# EAGLE design ATMega16Motherboard1 (EAGLE 6.2)
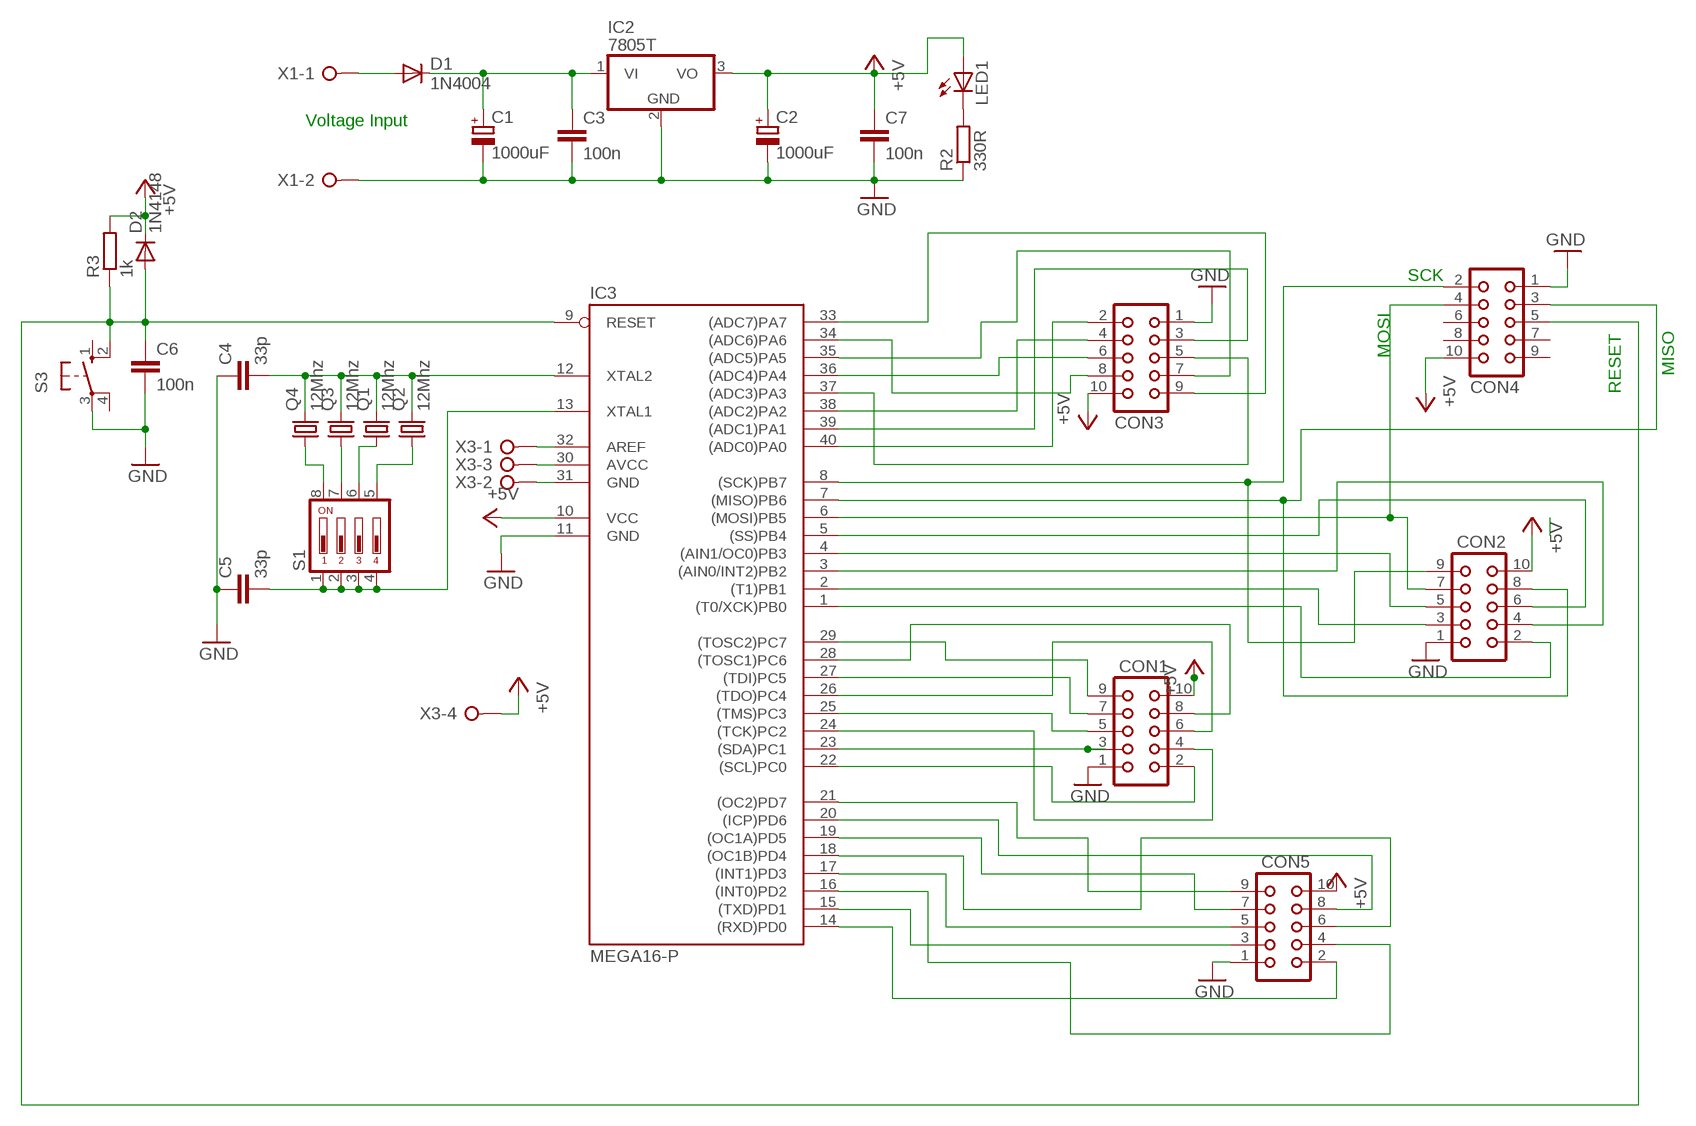
[diagram p0: schematic, sheet 1]

## Parts
C1  1000uF  CPOL-EUE2.5-7  [E2,5-7]
C2  1000uF  CPOL-EUE2.5-7  [E2,5-7]
C3  100n  C-EU025-024X044  [C025-024X044]
C4  33p  C-EU025-024X044  [C025-024X044]
C5  33p  C-EU025-024X044  [C025-024X044]
C6  100n  C-EU025-024X044  [C025-024X044]
C7  100n  C-EU025-024X044  [C025-024X044]
CON1  CON10  [CON10]
CON2  CON10  [CON10]
CON3  CON10  [CON10]
CON4  CON10  [CON10]
CON5  CON10  [CON10]
D1  1N4004  [DO41-10]
D2  1N4148  [DO35-10]
IC2  7805T  [TO220H]
IC3  MEGA16-P  [DIL40]
LED1  LED5MM  [LED5MM]
Q1  12Mhz  CRYSTALHC18U-V  [HC18U-V]
Q2  12Mhz  CRYSTALHC18U-V  [HC18U-V]
Q3  12Mhz  CRYSTALHC18U-V  [HC18U-V]
Q4  12Mhz  CRYSTALHC18U-V  [HC18U-V]
R2  330R  R-EU_0204/5  [0204/5]
R3  1k  R-EU_0204/5  [0204/5]
S1  DIP04YL  [DIP04YL]
S3  10-XX  [B3F-10XX]
X1  W237-02P  [W237-132]
X3  W237-04P  [W237-4P]

## Nets
+5V: C2.+ C7.1 CON1.10 CON2.10 CON3.10 CON4.10 CON5.10 D2.C IC2.3(VO) IC3.10(VCC) LED1.A R3.2 X3.4
GND: C1.- C2.- C3.2 C4.1 C5.1 C6.2 C7.2 CON1.1 CON2.1 CON3.1 CON4.1 CON5.1 IC2.2(GND) IC3.11(GND) R2.1 S3.3(P) X1.2
N$1: D1.A X1.1
N$2: C1.+ C3.1 D1.C IC2.1(VI)
N$3: CON1.2 IC3.22((SCL)PC0)
N$4: CON2.2 IC3.1((T0/XCK)PB0)
N$5: CON2.3 IC3.2((T1)PB1)
N$6: CON1.3 IC3.23((SDA)PC1)
N$7: IC3.32(AREF) X3.1
N$8: CON2.4 IC3.3((AIN0/INT2)PB2)
N$9: CON2.5 IC3.4((AIN1/OC0)PB3)
N$10: CON2.6 IC3.5((SS)PB4)
N$11: CON3.2 IC3.40((ADC0)PA0)
N$12: IC3.30(AVCC) X3.3
N$14: IC3.31(GND) X3.2
N$15: Q4.1 S1.8
N$16: Q3.1 S1.7
N$17: Q1.1 S1.6
N$18: Q2.1 S1.5
N$19: CON3.3 IC3.39((ADC1)PA1)
N$20: CON1.4 IC3.24((TCK)PC2)
N$21: LED1.K(C) R2.2
N$24: CON2.9 CON4.2 IC3.8((SCK)PB7)
N$25: CON2.7 CON4.4 IC3.6((MOSI)PB5)
N$26: CON2.8 CON4.3 IC3.7((MISO)PB6)
N$27: CON5.7 IC3.19((OC1A)PD5)
N$28: C5.2 IC3.13(XTAL1) S1.1 S1.2 S1.3 S1.4
N$29: C4.2 IC3.12(XTAL2) Q1.2 Q2.2 Q3.2 Q4.2
N$30: C6.1 CON4.5 D2.A IC3.9(RESET) R3.1 S3.2(S1)
N$31: CON3.4 IC3.38((ADC2)PA2)
N$32: CON3.5 IC3.37((ADC3)PA3)
N$33: CON3.6 IC3.36((ADC4)PA4)
N$34: CON3.7 IC3.35((ADC5)PA5)
N$36: CON3.8 IC3.34((ADC6)PA6)
N$37: CON3.9 IC3.33((ADC7)PA7)
N$38: CON1.5 IC3.25((TMS)PC3)
N$39: CON1.6 IC3.26((TDO)PC4)
N$40: CON1.7 IC3.27((TDI)PC5)
N$41: CON1.8 IC3.28((TOSC1)PC6)
N$42: CON1.9 IC3.29((TOSC2)PC7)
N$43: CON5.9 IC3.21((OC2)PD7)
N$44: CON5.8 IC3.20((ICP)PD6)
N$45: CON5.6 IC3.18((OC1B)PD4)
N$46: CON5.5 IC3.17((INT1)PD3)
N$47: CON5.4 IC3.16((INT0)PD2)
N$48: CON5.3 IC3.15((TXD)PD1)
N$49: CON5.2 IC3.14((RXD)PD0)
Unconnected: CON4.6 CON4.7 CON4.8 CON4.9 S3.1(S) S3.4(P1)

## Notes on the sheet
- Voltage Input
- SCK
- MOSI
- MISO
- RESET

## Library data of the parts
C1 C2 = rcl:CPOL-EU: POLARIZED CAPACITOR, European symbol
C3-C7 = rcl:C-EU: CAPACITOR, European symbol
CON1-CON5 = con-harting:CON10: CONNECTOR
D1 = diode:1N4004: DIODE general purpose rectifier, 1 A
D2 = diode:1N4148: DIODE high speed (Philips)
IC2 = linear:78*: Positive VOLTAGE REGULATOR Source: http://cache.national.com/ds/LM/LM78L05.pdf http://www.fairchildsemi.com/ds/LM/LM7805.pdf
IC3 = atmel:MEGA16-P: MICROCONTROLLER 16 Kbytes FLASH 1 kbytes SRAM 512 bytes EEPROM USART 8-channel 10 bit ADC Source: avr.lbr; MPN: ATMEGA16-16PU; OC_FARNELL: 9171142; OC_NEWARK: 01M6885
LED1 = led:LED: LED OSRAM: - CHIPLED LG R971, LG N971, LY N971, LG Q971, LY Q971, LO R971, LY R971 LH N974, LH R974 LS Q976, LO Q976, LY Q976 LO Q996 - Hyper CHIPLED LW Q18S LB Q993, LB Q99A, LB R99A - SideLED LS A670, LO A670, LY A670, LG A670, LP A670 LB A673, LV A673, LT A673, LW A673 LH A674 LY A675 LS A676, LA A676, LO A676, LY A676, LW A676 LS A679, LY A679, LG A679 - Hyper Micro SIDELED® LS Y876, LA Y876, LO Y876, LY Y876 LT Y87S - SmartLED LW L88C, LW L88S LB L89C, LB L89S, LG L890 LS L89K, LO L89K, LY L89K LS L896, LA L896, LO L896, LY L896 - TOPLED LS T670, LO T670, LY T670, LG T670, LP T670 LSG T670, LSP T670, LSY T670, LOP T670, LYG T670 LG T671, LOG T671, LSG T671 LB T673, LV T673, LT T673, LW T673 LH T674 LS T676, LA T676, LO T676, LY T676, LB T676, LH T676, LSB T676, LW T676 LB T67C, LV T67C, LT T67C, LS T67K, LO T67K, LY T67K, LW E67C LS E67B, LA E67B, LO E67B, LY E67B, LB E67C, LV E67C, LT E67C LW T67C LS T679, LY T679, LG T679 LS T770, LO T770, LY T770, LG T770, LP T770 LB T773, LV T773, LT T773, LW T773 LH T774 LS E675, LA E675, LY E675, LS T675 LS T776, LA T776, LO T776, LY T776, LB T776 LHGB T686 LT T68C, LB T68C - Hyper Mini TOPLED® LB M676 - Mini TOPLED Santana® LG M470 LS M47K, LO M47K, LY M47K Source: http://www.osram.convergy.de - LUMILED® LXK2-PW12-R00, LXK2-PW12-S00, LXK2-PW14-U00, LXK2-PW14-V00 LXK2-PM12-R00, LXK2-PM12-S00, LXK2-PM14-U00 LXK2-PE12-Q00, LXK2-PE12-R00, LXK2-PE12-S00, LXK2-PE14-T00, LXK2-PE14-U00 LXK2-PB12-K00, LXK2-PB12-L00, LXK2-PB12-M00, LXK2-PB14-N00, LXK2-PB14-P00, LXK2-PB14-Q00 LXK2-PR12-L00, LXK2-PR12-M00, LXK2-PR14-Q00, LXK2-PR14-R00 LXK2-PD12-Q00, LXK2-PD12-R00, LXK2-PD12-S00 LXK2-PH12-R00, LXK2-PH12-S00 LXK2-PL12-P00, LXK2-PL12-Q00, LXK2-PL12-R00 Source: www.luxeon.com
Q1-Q4 = crystal:CRYSTAL: CRYSTAL
R2 R3 = rcl:R-EU_: RESISTOR, European symbol
S1 = switch-dil:DIP04YL: DIL/CODE SWITCH; OC_FARNELL: unknown; OC_NEWARK: unknown
S3 = switch-omron:10-XX: OMRON SWITCH; MPN: B3F-1000; OC_FARNELL: 176432; OC_NEWARK: 36M3542
X1 = con-wago-508:W237-02P: WAGO SREW CLAMP; OC_FARNELL: unknown; OC_NEWARK: unknown
X3 = con-wago-508:W237-04P: WAGO SREW CLAMP; OC_FARNELL: unknown; OC_NEWARK: unknown

## Board
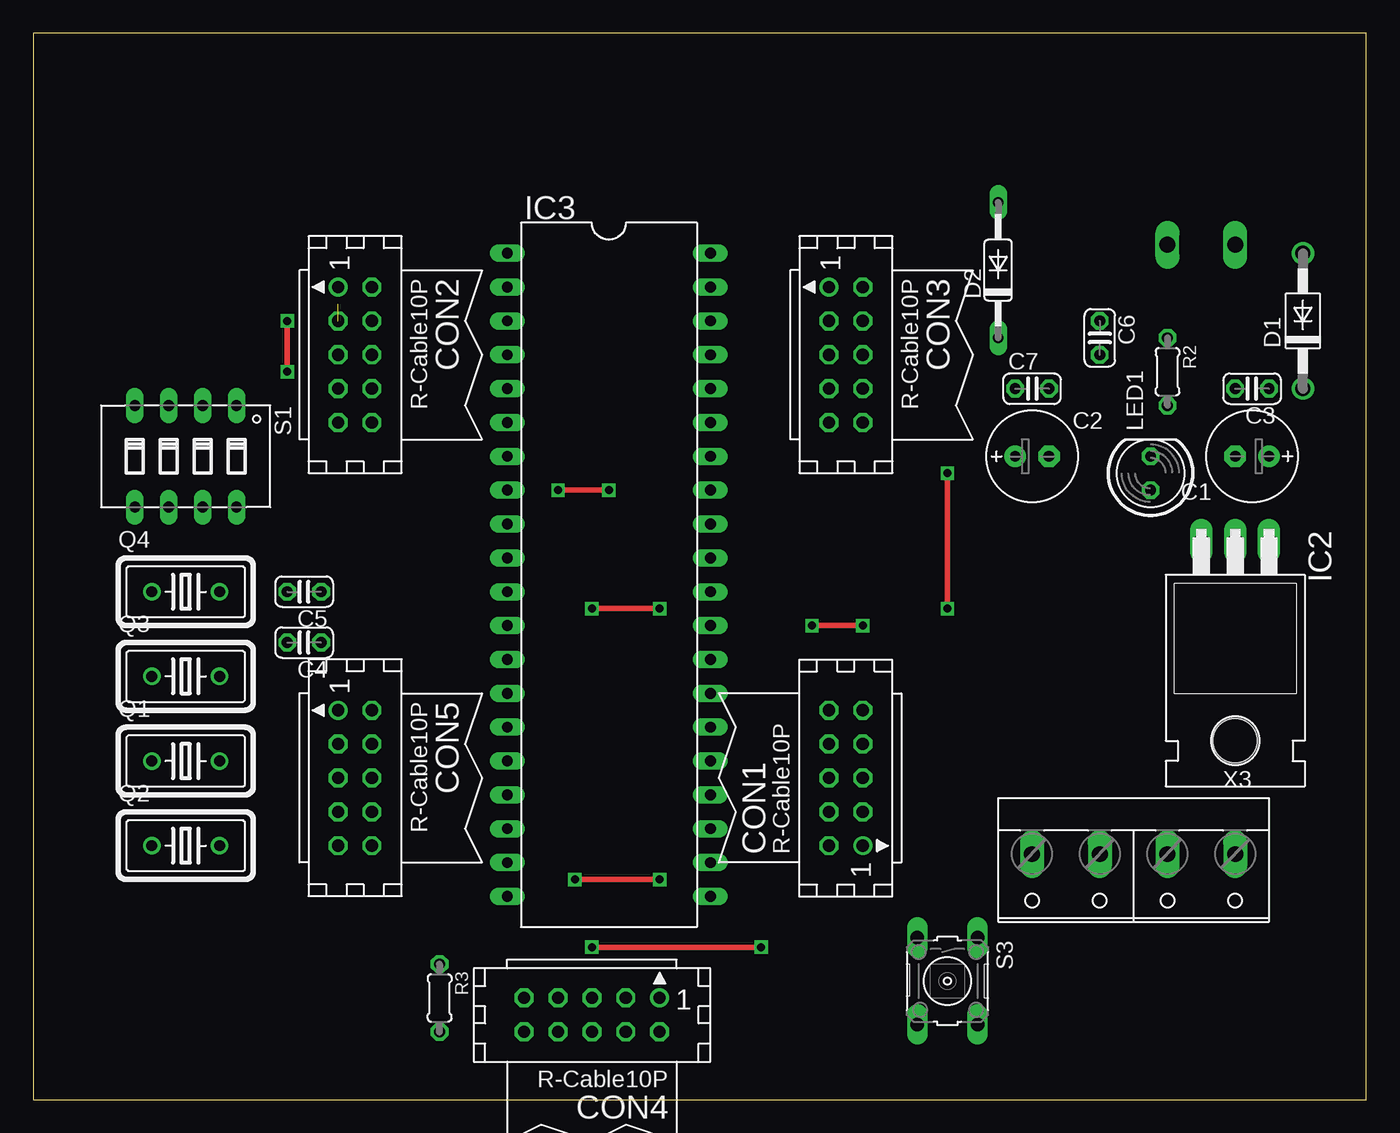
[diagram p1: board, top side]
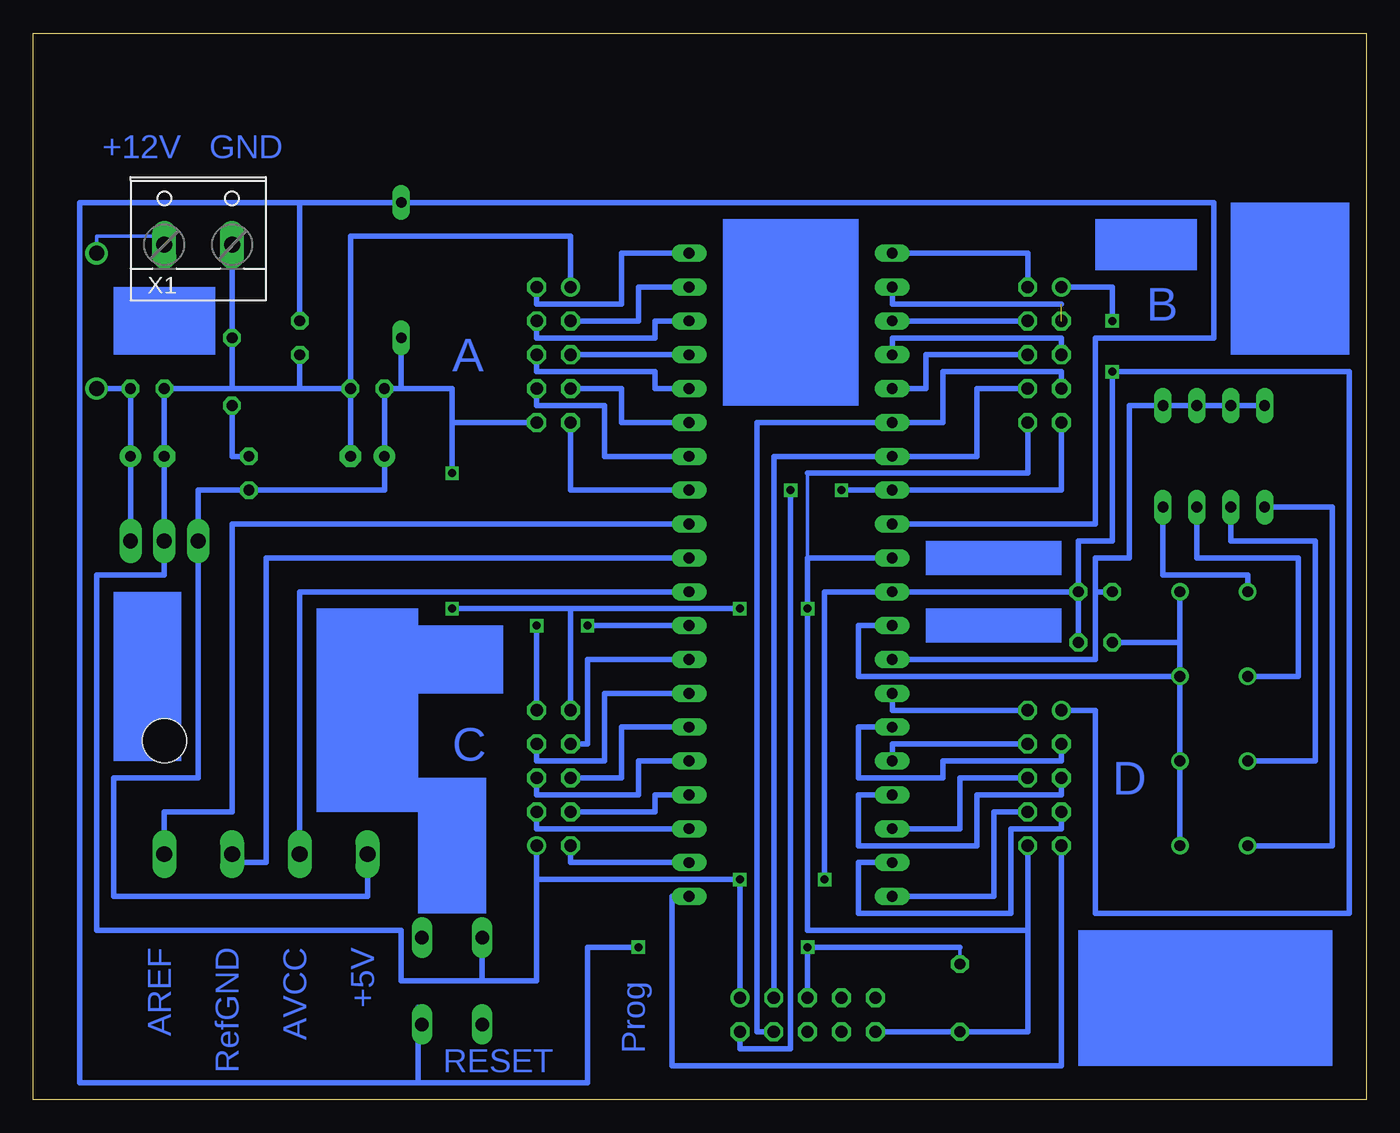
[diagram p2: board, bottom side, seen from below]

Size 100 x 80 mm. Coordinates in mm from the lower left corner, seen from the top.
Outline: 0,0 100,0 100,80 0,80 0,0
Copper layers (1*16): Top 0.035mm / dielectric 1.5mm / Bottom 0.035mm
Design rules: minimum track width 10mil, minimum drill 24mil, track to track 8mil, track to pad 8mil, pad to pad 8mil, via to via 8mil, smd to smd 8mil, copper to edge 40mil, drill to drill 8mil, minimum pad ring 10mil, minimum via ring 8mil, stop-mask expansion 4mil, vias tented up to drill 0mil, thermal gap 10mil

### Footprints (pad centres in the part's own frame; a part is rotated, then mirrored left to right if it is on the bottom)
E2,5-7 = drill 0.813 pad 1.6: + -1.27,0 | drill 0.813 pad 1.6 octagon: - 1.27,0
C025-024X044 = drill 0.813 octagon: 1 -1.27,0; 2 1.27,0
CON10 = drill 0.914: 1 -5.08,-1.27 | drill 0.914 octagon: 2 -5.08,1.27; 3 -2.54,-1.27; 4 -2.54,1.27; 5 0,-1.27; 6 0,1.27; 7 2.54,-1.27; 8 2.54,1.27; 9 5.08,-1.27; 10 5.08,1.27
DO41-10 = drill 1.118: A 5.08,0; C -5.08,0
DO35-10 = drill 0.813 long: A 5.08,0; C -5.08,0
TO220H = drill 1.118 long: 1 -2.54,-10.16; 2 0,-10.16; 3 2.54,-10.16 | hole 3.302: 0,4.826
DIL40 = drill 0.813 long: 1 -24.13,-7.62; 2 -21.59,-7.62; 3 -19.05,-7.62; 4 -16.51,-7.62; 5 -13.97,-7.62; 6 -11.43,-7.62; 7 -8.89,-7.62; 8 -6.35,-7.62; 9 -3.81,-7.62; 10 -1.27,-7.62; 11 1.27,-7.62; 12 3.81,-7.62; 13 6.35,-7.62; 14 8.89,-7.62; 15 11.43,-7.62; 16 13.97,-7.62; 17 16.51,-7.62; 18 19.05,-7.62; 19 21.59,-7.62; 20 24.13,-7.62; 21 24.13,7.62; 22 21.59,7.62; 23 19.05,7.62; 24 16.51,7.62; 25 13.97,7.62; 26 11.43,7.62; 27 8.89,7.62; 28 6.35,7.62; 29 3.81,7.62; 30 1.27,7.62; 31 -1.27,7.62; 32 -3.81,7.62; 33 -6.35,7.62; 34 -8.89,7.62; 35 -11.43,7.62; 36 -13.97,7.62; 37 -16.51,7.62; 38 -19.05,7.62; 39 -21.59,7.62; 40 -24.13,7.62
LED5MM = drill 0.813 octagon: A -1.27,0; K 1.27,0
HC18U-V = drill 0.813: 1 -2.54,0; 2 2.54,0
0204/5 = drill 0.813 octagon: 1 -2.54,0; 2 2.54,0
DIP04YL = drill 0.813 long: 1 -3.81,-3.81; 2 -1.27,-3.81; 3 1.27,-3.81; 4 3.81,-3.81; 5 3.81,3.81; 6 1.27,3.81; 7 -1.27,3.81; 8 -3.81,3.81
B3F-10XX = drill 1.016 long: 1 -3.251,2.261; 2 3.251,2.261; 3 -3.251,-2.261; 4 3.251,-2.261
W237-132 = drill 1.194 long: 1 -2.54,-0.635; 2 2.54,-0.635
W237-4P = drill 1.194 long: 1 -7.62,-0.635; 2 -2.54,-0.635; 3 2.54,-0.635; 4 7.62,-0.635

### Placement (x,y rotation side)
C1  91.44,48.26 180 top
C2  74.93,48.26 0 top
C3  91.44,53.34 180 top
C4  20.32,34.29 180 top
C5  20.32,38.1 180 top
C6  80.01,57.15 270 top
C7  74.93,53.34 0 top
CON1  60.96,24.13 90 top
CON2  24.13,55.88 270 top
CON3  60.96,55.88 270 top
CON4  41.91,6.35 180 top
CON5  24.13,24.13 270 top
D1  95.25,58.42 90 top
D2  72.39,62.23 90 top
IC2  90.17,31.75 180 top
IC3  43.18,39.37 270 top
LED1  83.82,46.99 90 top
Q1  11.43,25.4 0 top
Q2  11.43,19.05 0 top
Q3  11.43,31.75 0 top
Q4  11.43,38.1 0 top
R2  85.09,54.61 270 top
R3  30.48,7.62 270 top
S1  11.43,48.26 180 top
S3  68.58,8.89 270 top
X1  87.63,64.77 0 bottom
X3  82.55,17.78 180 top

### Tracks (layer width: path | path; a pad name or v marks a point on that pad's centre or on a via)
+5V  (via drill 0.6)
  Top 0.406: v46.99,36.83 v41.91,36.83 | v68.58,36.83 v68.58,46.99
  Bottom 0.254: 41.91,46.99 41.91,40.64
  Bottom 0.406: 68.58,50.8 68.58,53.34 72.39,53.34 | 72.39,53.34 C7.1 C2.+ 73.66,45.72 LED1.A 87.63,45.72 IC2.3 87.63,24.13 93.98,24.13 93.98,15.24 74.93,15.24 X3.4 | D2.C 72.39,53.34 | IC3.10 41.91,40.64 v41.91,36.83 41.91,12.7 25.4,12.7 | CON1.10 59.69,36.83 | 59.69,36.83 v46.99,36.83 | 59.69,36.83 v68.58,36.83 | v68.58,46.99 68.58,50.8 | 68.58,50.8 CON3.10 | CON2.10 25.4,46.99 41.91,46.99 | 25.4,12.7 25.4,5.08 R3.2 CON4.10 | CON5.10 25.4,12.7
GND  (via drill 0.6)
  Top 0.406: v40.64,16.51 v46.99,16.51 | v19.05,58.42 v19.05,54.61
  Bottom 0.406: C7.2 76.2,64.77 59.69,64.77 CON3.1 | 62.23,16.51 62.23,8.89 66.32,8.89 | 66.32,8.89 S3.3 | 66.32,8.89 72.39,8.89 72.39,12.7 95.25,12.7 95.25,39.37 90.17,39.37 IC2.2 C1.- C3.2 85.09,53.34 | CON1.1 62.23,16.51 | 62.23,16.51 v46.99,16.51 CON4.1 | X1.2 R2.1 85.09,53.34 | v40.64,16.51 40.64,38.1 IC3.11 C5.1 | C5.1 C4.1 | CON2.1 19.05,60.96 v19.05,58.42 | C5.1 21.59,41.91 19.05,41.91 v19.05,54.61 1.27,54.61 1.27,13.97 20.32,13.97 20.32,29.21 CON5.1 | C7.2 80.01,53.34 | 80.01,53.34 C6.2 | 85.09,53.34 80.01,53.34 | C7.2 C2.-
N$1
  Bottom 0.254: D1.A 95.25,64.77 90.17,64.77 X1.1
N$2
  Bottom 0.406: IC2.1 C1.+ C3.1 D1.C
N$3
  Bottom 0.406: CON1.2 59.69,17.78 IC3.22
N$4
  Bottom 0.406: CON2.2 25.4,63.5 IC3.1
N$5  (1 unrouted)
  Bottom 0.406: 22.86,59.69 35.56,59.69 IC3.2
N$6
  Bottom 0.406: CON1.3 62.23,20.32 IC3.23
N$7
  Bottom 0.406: IC3.32 85.09,43.18 85.09,21.59 90.17,21.59 X3.1
N$8
  Bottom 0.406: IC3.3 CON2.4
N$9
  Bottom 0.406: IC3.4 35.56,57.15 22.86,57.15 CON2.5
N$10
  Bottom 0.406: IC3.5 33.02,53.34 33.02,55.88 CON2.6
N$11
  Bottom 0.406: CON3.2 62.23,59.69 55.88,59.69 55.88,63.5 IC3.40
N$12
  Bottom 0.406: IC3.30 80.01,38.1 X3.3
N$14
  Bottom 0.406: IC3.31 82.55,40.64 82.55,17.78 85.09,17.78 X3.2
N$15
  Bottom 0.406: S1.8 15.24,39.37 8.89,39.37 Q4.1
N$16
  Bottom 0.406: S1.7 12.7,40.64 5.08,40.64 5.08,31.75 Q3.1
N$17
  Bottom 0.406: S1.6 10.16,41.91 3.81,41.91 3.81,25.4 Q1.1
N$18
  Bottom 0.406: S1.5 2.54,44.45 2.54,19.05 Q2.1
N$19
  Bottom 0.406: CON3.3 54.61,58.42 54.61,60.96 IC3.39
N$20
  Bottom 0.406: CON1.4 53.34,21.59 53.34,22.86 IC3.24
N$21
  Bottom 0.406: LED1.K 85.09,48.26 R2.2
N$24  (via drill 0.6)
  Top 0.406: v43.18,45.72 v39.37,45.72
  Bottom 0.406: CON4.2 46.99,3.81 43.18,3.81 v43.18,45.72 | v39.37,45.72 IC3.8 22.86,45.72 CON2.9
N$25
  Bottom 0.406: CON4.4 45.72,5.08 45.72,50.8 IC3.6 31.75,50.8 31.75,54.61 22.86,54.61 CON2.7
N$26
  Bottom 0.406: CON2.8 29.21,53.34 29.21,48.26 IC3.7 44.45,48.26 CON4.3
N$27
  Bottom 0.406: CON5.7 22.86,20.32 26.67,20.32 26.67,13.97 38.1,13.97 38.1,17.78 IC3.19
N$28
  Bottom 0.406: S1.4 S1.3 S1.2 S1.1 17.78,52.07 17.78,40.64 20.32,40.64 20.32,38.1 | 20.32,38.1 20.32,33.02 IC3.13 | C5.2 20.32,38.1
N$29
  Bottom 0.406: Q3.2 Q1.2 Q2.2 | 13.97,34.29 Q3.2 | Q3.2 38.1,31.75 38.1,35.56 IC3.12 | C4.2 13.97,34.29 | 13.97,34.29 Q4.2
N$30  (via drill 0.6)
  Top 0.406: v41.91,11.43 v54.61,11.43
  Bottom 0.254: 30.48,11.43 R3.1
  Bottom 0.406: CON4.5 v41.91,11.43 30.48,11.43 | v54.61,11.43 58.42,11.43 58.42,1.27 71.12,1.27 | D2.A 80.01,67.31 C6.1 | S3.2 71.12,6.91 71.12,1.27 | D2.A 96.52,67.31 96.52,1.27 71.12,1.27 | IC3.9 20.32,43.18 20.32,57.15 11.43,57.15 11.43,67.31 D2.A
N$31
  Bottom 0.406: CON3.4 62.23,57.15 53.34,57.15 53.34,58.42 IC3.38
N$32
  Bottom 0.406: IC3.37 CON3.5
N$33
  Bottom 0.406: CON3.6 62.23,54.61 53.34,54.61 53.34,53.34 IC3.36
N$34
  Bottom 0.406: CON3.7 55.88,53.34 55.88,50.8 IC3.35
N$36
  Bottom 0.406: CON3.8 62.23,52.07 57.15,52.07 57.15,48.26 IC3.34
N$37
  Bottom 0.406: CON3.9 59.69,45.72 IC3.33
N$38
  Bottom 0.406: CON1.5 62.23,22.86 54.61,22.86 54.61,25.4 IC3.25
N$39
  Bottom 0.406: CON1.6 55.88,24.13 55.88,27.94 IC3.26
N$40
  Bottom 0.406: CON1.7 62.23,25.4 57.15,25.4 57.15,30.48 IC3.27
N$41
  Bottom 0.406: CON1.8 58.42,26.67 58.42,33.02 IC3.28
N$42  (via drill 0.6)
  Top 0.406: v58.42,35.56 v62.23,35.56
  Bottom 0.406: IC3.29 v58.42,35.56 | v62.23,35.56 CON1.9
N$43
  Bottom 0.406: CON5.9 22.86,2.54 52.07,2.54 52.07,15.24 IC3.21
N$44
  Bottom 0.406: CON5.8 27.94,21.59 27.94,15.24 IC3.20
N$45
  Bottom 0.406: CON5.6 30.48,24.13 30.48,20.32 IC3.18
N$46
  Bottom 0.406: CON5.5 22.86,22.86 29.21,22.86 29.21,19.05 38.1,19.05 38.1,22.86 IC3.17
N$47
  Bottom 0.406: IC3.16 35.56,26.67 CON5.4
N$48
  Bottom 0.406: CON5.3 22.86,25.4 31.75,25.4 31.75,24.13 38.1,24.13 38.1,27.94 IC3.15
N$49
  Bottom 0.406: CON5.2 35.56,29.21 IC3.14
(copper drawn outside any net)
  shapes: Bottom area x13

### Text on the board
Bottom: GND | +12V | B | A | C | D | +5V | AVCC | RefGND | AREF | Prog | RESET